# Altium schematic sheet Sheet_FUNC.SchDoc
size A4
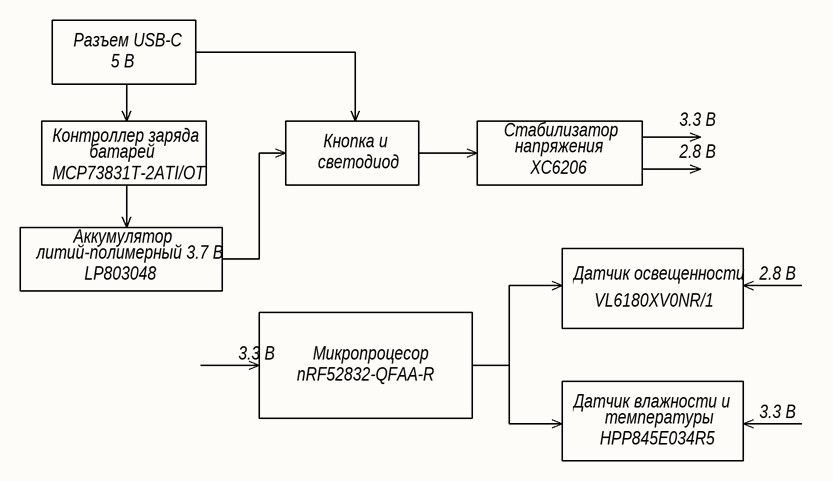
[diagram p0: Sheet_FUNC.SchDoc]

## Notes on the sheet
- Разъем USB-C
- 5 В
- 3.3 В
- Контроллер заряда
- MCP73831T-2ATI/OT
- батарей
- светодиод
- Кнопка и
- Стабилизатор
- напряжения
- XC6206
- 2.8 В
- литий-полимерный 3.7 В
- Аккумулятор
- LP803048
- Датчик освещенности
- VL6180XV0NR/1
- nRF52832-QFAA-R
- Микропроцесор
- Датчик влажности и
- HPP845E034R5
- температуры